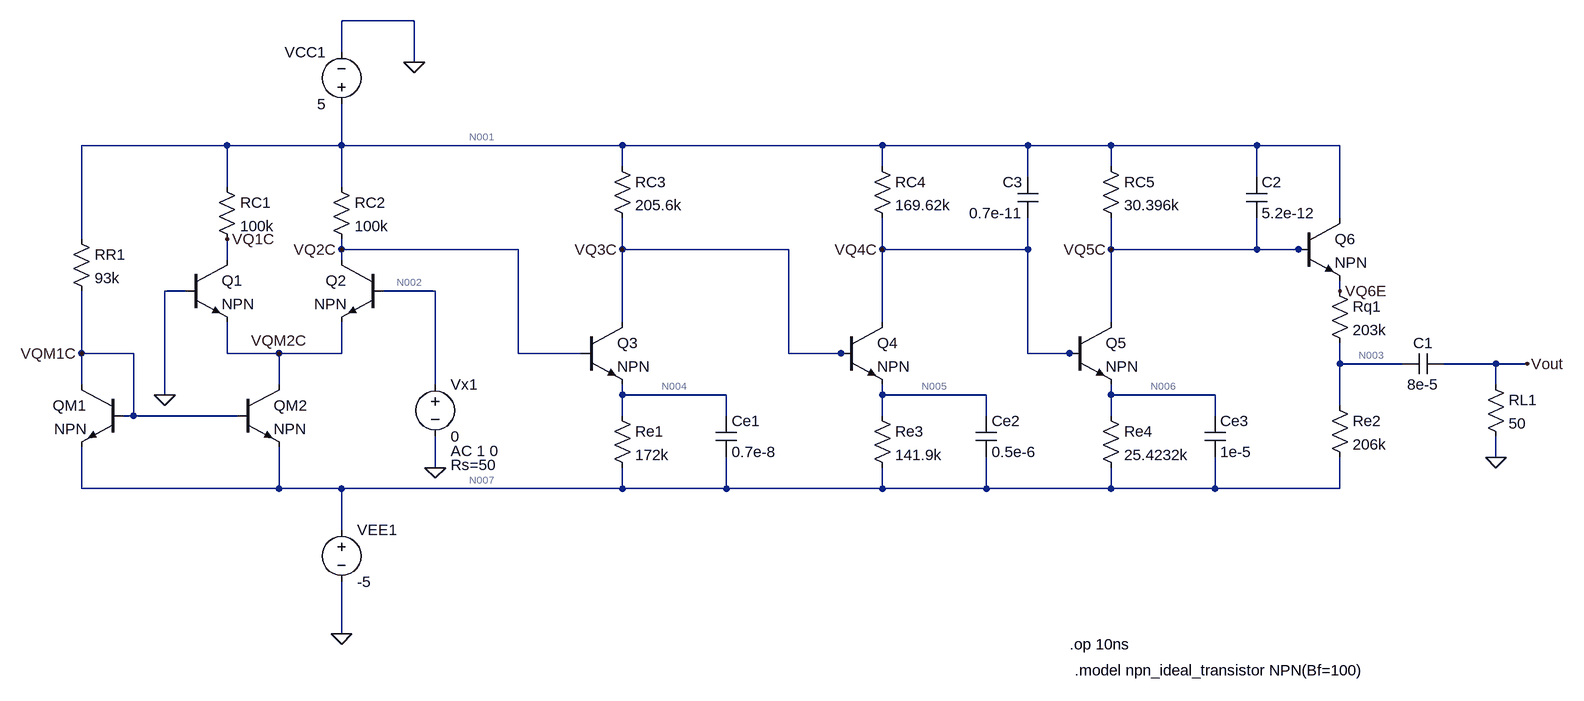
[diagram p0: schematic Bias Points.asc]
Bias Points.asc, the LTspice schematic file:
Version 4
SHEET 1 1460 848
WIRE -480 -288 -592 -288
WIRE -592 -240 -592 -288
WIRE -480 -224 -480 -288
WIRE -768 -96 -992 -96
WIRE -592 -96 -592 -160
WIRE -592 -96 -768 -96
WIRE -160 -96 -592 -96
WIRE 240 -96 -160 -96
WIRE 464 -96 240 -96
WIRE 592 -96 464 -96
WIRE 816 -96 592 -96
WIRE 944 -96 816 -96
WIRE -160 -64 -160 -96
WIRE 240 -64 240 -96
WIRE 592 -64 592 -96
WIRE 464 -48 464 -96
WIRE 816 -48 816 -96
WIRE -768 -32 -768 -96
WIRE -592 -32 -592 -96
WIRE 944 16 944 -96
WIRE -992 48 -992 -96
WIRE -592 64 -592 48
WIRE -320 64 -592 64
WIRE -160 64 -160 16
WIRE 96 64 -160 64
WIRE 240 64 240 16
WIRE 464 64 464 16
WIRE 464 64 240 64
WIRE 592 64 592 16
WIRE 816 64 816 16
WIRE 816 64 592 64
WIRE 880 64 816 64
WIRE 896 64 880 64
WIRE -768 80 -768 48
WIRE -592 80 -592 64
WIRE -832 128 -864 128
WIRE -448 128 -528 128
WIRE 944 128 944 112
WIRE -160 176 -160 64
WIRE 240 176 240 64
WIRE 592 176 592 64
WIRE -992 224 -992 128
WIRE -912 224 -992 224
WIRE -768 224 -768 176
WIRE -688 224 -768 224
WIRE -592 224 -592 176
WIRE -592 224 -688 224
WIRE -320 224 -320 64
WIRE -224 224 -320 224
WIRE 96 224 96 64
WIRE 176 224 96 224
WIRE 192 224 176 224
WIRE 464 224 464 64
WIRE 528 224 464 224
WIRE 544 224 528 224
WIRE 944 240 944 208
WIRE 1040 240 944 240
WIRE 1184 240 1104 240
WIRE 1232 240 1184 240
WIRE -992 272 -992 224
WIRE -688 272 -688 224
WIRE -448 272 -448 128
WIRE 1184 272 1184 240
WIRE -864 288 -864 128
WIRE -160 288 -160 272
WIRE 0 288 -160 288
WIRE 240 288 240 272
WIRE 400 288 240 288
WIRE 592 288 592 272
WIRE 752 288 592 288
WIRE 944 304 944 240
WIRE -912 320 -912 224
WIRE -912 320 -928 320
WIRE -752 320 -912 320
WIRE -160 320 -160 288
WIRE 0 320 0 288
WIRE 240 320 240 288
WIRE 400 320 400 288
WIRE 592 320 592 288
WIRE 752 320 752 288
WIRE 1184 384 1184 352
WIRE -448 400 -448 352
WIRE -992 432 -992 368
WIRE -688 432 -688 368
WIRE -688 432 -992 432
WIRE -592 432 -688 432
WIRE -160 432 -160 400
WIRE -160 432 -592 432
WIRE 0 432 0 384
WIRE 0 432 -160 432
WIRE 240 432 240 400
WIRE 240 432 0 432
WIRE 400 432 400 384
WIRE 400 432 240 432
WIRE 592 432 592 400
WIRE 592 432 400 432
WIRE 752 432 752 384
WIRE 752 432 592 432
WIRE 944 432 944 384
WIRE 944 432 752 432
WIRE -592 496 -592 432
WIRE -592 656 -592 576
FLAG -592 656 0
FLAG -480 -224 0
FLAG -448 400 0
FLAG 1184 384 0
FLAG 1232 240 Vout
FLAG -864 288 0
FLAG -768 48 VQ1C
FLAG -592 64 VQ2C
FLAG -688 224 VQM2C
FLAG -992 224 VQM1C
FLAG -160 64 VQ3C
FLAG 240 64 VQ4C
FLAG 592 64 VQ5C
FLAG 944 128 VQ6E
SYMBOL res -784 -48 R0
SYMATTR InstName RC1
SYMATTR Value 100k
SYMBOL res -608 -48 R0
SYMATTR InstName RC2
SYMATTR Value 100k
SYMBOL Res -176 304 R0
SYMATTR InstName Re1
SYMATTR Value 172k
SYMBOL Res -1008 32 R0
SYMATTR InstName RR1
SYMATTR Value 93k
SYMBOL Res -176 -80 R0
SYMATTR InstName RC3
SYMATTR Value 205.6k
SYMBOL npn -832 80 R0
SYMATTR InstName Q1
SYMBOL npn -224 176 R0
SYMATTR InstName Q3
SYMBOL npn -752 272 R0
SYMATTR InstName QM2
SYMBOL npn -928 272 M0
SYMATTR InstName QM1
SYMBOL npn -528 80 M0
SYMATTR InstName Q2
SYMBOL voltage -592 480 R0
SYMATTR InstName VEE1
SYMATTR Value -5
SYMBOL voltage -592 -144 R180
WINDOW 0 24 96 Left 2
WINDOW 3 24 16 Left 2
SYMATTR InstName VCC1
SYMATTR Value 5
SYMBOL voltage -448 256 R0
WINDOW 123 24 118 Left 2
WINDOW 39 24 140 Left 2
SYMATTR Value2 AC 1 0
SYMATTR SpiceLine Rs=50
SYMATTR InstName Vx1
SYMATTR Value 0
SYMBOL cap -16 320 R0
SYMATTR InstName Ce1
SYMATTR Value 0.7e-8
SYMBOL npn 880 16 R0
SYMATTR InstName Q6
SYMBOL Res 928 288 R0
SYMATTR InstName Re2
SYMATTR Value 206k
SYMBOL Res 1168 256 R0
SYMATTR InstName RL1
SYMATTR Value 50
SYMBOL cap 1104 224 R90
WINDOW 0 0 32 VBottom 2
WINDOW 3 32 32 VTop 2
SYMATTR InstName C1
SYMATTR Value 8e-5
SYMBOL Res 224 304 R0
SYMATTR InstName Re3
SYMATTR Value 141.9k
SYMBOL Res 224 -80 R0
SYMATTR InstName RC4
SYMATTR Value 169.62k
SYMBOL npn 176 176 R0
SYMATTR InstName Q4
SYMBOL cap 384 320 R0
SYMATTR InstName Ce2
SYMATTR Value 0.5e-6
SYMBOL Res 928 112 R0
SYMATTR InstName Rq1
SYMATTR Value 203k
SYMBOL Res 576 304 R0
SYMATTR InstName Re4
SYMATTR Value 25.4232k
SYMBOL Res 576 -80 R0
SYMATTR InstName RC5
SYMATTR Value 30.396k
SYMBOL npn 528 176 R0
SYMATTR InstName Q5
SYMBOL cap 736 320 R0
SYMATTR InstName Ce3
SYMATTR Value 1e-5
SYMBOL cap 800 -48 R0
SYMATTR InstName C2
SYMATTR Value 5.2e-12
SYMBOL cap 480 16 R180
WINDOW 0 24 56 Left 2
WINDOW 3 24 8 Left 2
SYMATTR InstName C3
SYMATTR Value 0.7e-11
TEXT 528 672 Left 2 !.op 10ns
TEXT 536 712 Left 2 !.model npn_ideal_transistor NPN(Bf=100)

The netlist it stands for:
* Bias Points.asc
RC1 N001 VQ1C 100k
RC2 N001 VQ2C 100k
Re1 N004 N007 172k
RR1 N001 VQM1C 93k
RC3 N001 VQ3C 205.6k
Q1 VQ1C 0 VQM2C 0 NPN
Q3 VQ3C VQ2C N004 0 NPN
QM2 VQM2C VQM1C N007 0 NPN
QM1 VQM1C VQM1C N007 0 NPN
Q2 VQ2C N002 VQM2C 0 NPN
VEE1 N007 0 -5
VCC1 N001 0 5
Vx1 N002 0 0 AC 1 0 Rs=50
Ce1 N004 N007 0.7e-8
Q6 N001 VQ5C VQ6E 0 NPN
Re2 N003 N007 206k
RL1 Vout 0 50
C1 Vout N003 8e-5
Re3 N005 N007 141.9k
RC4 N001 VQ4C 169.62k
Q4 VQ4C VQ3C N005 0 NPN
Ce2 N005 N007 0.5e-6
Rq1 VQ6E N003 203k
Re4 N006 N007 25.4232k
RC5 N001 VQ5C 30.396k
Q5 VQ5C VQ4C N006 0 NPN
Ce3 N006 N007 1e-5
C2 N001 VQ5C 5.2e-12
C3 VQ4C N001 0.7e-11
.model NPN NPN
.model PNP PNP
.lib standard.bjt
.op 10ns
.model npn_ideal_transistor NPN(Bf=100)
.backanno
.end

* Results of the author's LTspice run, read from the files saved beside the schematic
* Operating Point:
*   V(n001) = 5 V
*   V(vq1c) = 153.9 mV
*   V(vq2c) = 128 mV
*   V(n004) = -551.5 mV
*   V(n007) = -5 V
*   V(vqm1c) = -4.286 V
*   V(vq3c) = -321.5 mV
*   V(vqm2c) = -695.9 mV
*   V(n002) = 0 V
*   V(vq5c) = -46.55 mV
*   V(vq6e) = -702.7 mV
*   V(n003) = -2.836 V
*   V(vout) = -11.34 fV
*   V(n005) = -1.003 V
*   V(vq4c) = -11.76 mV
*   V(n006) = -739.5 mV
*   Ic(Q5) = 165.9 µA
*   Ib(Q5) = 1.659 µA
*   Ie(Q5) = -167.6 µA
*   Ic(Q4) = 27.89 µA
*   Ib(Q4) = 278.9 nA
*   Ie(Q4) = -28.17 µA
*   Ic(Q6) = 10.4 µA
*   Ib(Q6) = 104 nA
*   Ie(Q6) = -10.51 µA
*   Ic(Q2) = 48.46 µA
*   Ib(Q2) = 484.6 nA
*   Ie(Q2) = -48.95 µA
*   Ic(Qm1) = 97.89 µA
*   Ib(Qm1) = 978.9 nA
*   Ie(Qm1) = -98.87 µA
*   Ic(Qm2) = 97.89 µA
*   Ib(Qm2) = 978.9 nA
*   Ie(Qm2) = -98.87 µA
*   Ic(Q3) = 25.6 µA
*   Ib(Q3) = 259.6 nA
*   Ie(Q3) = -25.86 µA
*   Ic(Q1) = 48.46 µA
*   Ib(Q1) = 484.6 nA
*   Ie(Q1) = -48.95 µA
*   I(C3) = 0 A
*   I(C2) = 0 A
*   I(Ce3) = 0 A
*   I(Ce2) = 0 A
*   I(C1) = 0 A
*   I(Ce1) = 0 A
*   I(Rc5) = 166 µA
*   I(Re4) = 167.6 µA
*   I(Rq1) = 10.51 µA
*   I(Rc4) = 29.55 µA
*   I(Re3) = 28.17 µA
*   I(Rl1) = 0 A
*   I(Re2) = 10.51 µA
*   I(Rc3) = 25.88 µA
*   I(Rr1) = 99.85 µA
*   I(Re1) = 25.86 µA
*   I(Rc2) = 48.72 µA
*   I(Rc1) = 48.46 µA
*   I(Vx1) = -484.6 nA
*   I(Vcc1) = -428.9 µA
*   I(Vee1) = 429.9 µA
* From the log:
*   Semiconductor Device Operating Points:
*                           --- Bipolar Transistors ---
*   Name:       q5          q4          q6          q2          qm1
*   Model:      npn         npn         npn         npn         npn
*   Ib:       1.66e-06    2.79e-07    1.04e-07    4.85e-07    9.79e-07
*   Ic:       1.66e-04    2.79e-05    1.04e-05    4.85e-05    9.79e-05
*   Vbe:      7.28e-01    6.82e-01    6.56e-01    6.96e-01    7.14e-01
*   Vbc:      3.48e-02   -3.10e-01   -5.05e+00   -1.28e-01    0.00e+00
*   Vce:      6.93e-01    9.91e-01    5.70e+00    8.24e-01    7.14e-01
*   BetaDC:   1.00e+02    1.00e+02    1.00e+02    1.00e+02    1.00e+02
*   Gm:       6.41e-03    1.08e-03    4.02e-04    1.87e-03    3.78e-03
*   Rpi:      1.56e+04    9.27e+04    2.49e+05    5.34e+04    2.64e+04
*   Rx:       0.00e+00    0.00e+00    0.00e+00    0.00e+00    0.00e+00
*   Ro:       6.74e+13    4.11e+19    0.00e+00    3.64e+16    2.59e+14
*   Cbe:      0.00e+00    0.00e+00    0.00e+00    0.00e+00    0.00e+00
*   Cbc:      0.00e+00    0.00e+00    0.00e+00    0.00e+00    0.00e+00
*   Cjs:      0.00e+00    0.00e+00    0.00e+00    0.00e+00    0.00e+00
*   BetaAC:   1.00e+02    1.00e+02    1.00e+02    1.00e+02    1.00e+02
*   Cbx:      0.00e+00    0.00e+00    0.00e+00    0.00e+00    0.00e+00
*   Ft:       0.00e+00    0.00e+00    0.00e+00    0.00e+00    0.00e+00
*   Name:       qm2         q3          q1
*   Model:      npn         npn         npn
*   Ib:       9.79e-07    2.60e-07    4.85e-07
*   Ic:       9.79e-05    2.56e-05    4.85e-05
*   Vbe:      7.14e-01    6.79e-01    6.96e-01
*   Vbc:     -3.59e+00    4.49e-01   -1.54e-01
*   Vce:      4.30e+00    2.30e-01    8.50e-01
*   BetaDC:   1.00e+02    9.86e+01    1.00e+02
*   Gm:       3.78e-03    9.90e-04    1.87e-03
*   Rpi:      2.64e+04    1.01e+05    5.34e+04
*   Rx:       0.00e+00    0.00e+00    0.00e+00
*   Ro:       4.91e+74    7.33e+06    9.94e+16
*   Cbe:      0.00e+00    0.00e+00    0.00e+00
*   Cbc:      0.00e+00    0.00e+00    0.00e+00
*   Cjs:      0.00e+00    0.00e+00    0.00e+00
*   BetaAC:   1.00e+02    1.00e+02    1.00e+02
*   Cbx:      0.00e+00    0.00e+00    0.00e+00
*   Ft:       0.00e+00    0.00e+00    0.00e+00
*   Operating Bias Point Solution:
*   V(n001)                  5   voltage
*   V(vq1c)           0.153944   voltage
*   V(vq2c)            0.12798   voltage
*   V(n004)          -0.551463   voltage
*   V(n007)                 -5   voltage
*   V(vqm1c)           -4.28588   voltage
*   V(vq3c)          -0.321509   voltage
*   V(vqm2c)          -0.695938   voltage
*   V(n002)                  0   voltage
*   V(vq5c)         -0.0465492   voltage
*   V(vq6e)           -0.70269   voltage
*   V(n003)           -2.83558   voltage
*   V(vout)       -1.13423e-14   voltage
*   V(n005)           -1.00316   voltage
*   V(vq4c)         -0.0117585   voltage
*   V(n006)           -0.73953   voltage
*   Ic(Q5)        0.000165923   device_current
*   Ib(Q5)        1.65923e-06   device_current
*   Ie(Q5)       -0.000167582   device_current
*   Ic(Q4)        2.78878e-05   device_current
*   Ib(Q4)        2.78878e-07   device_current
*   Ie(Q4)       -2.81666e-05   device_current
*   Ic(Q6)        1.04028e-05   device_current
*   Ib(Q6)        1.04024e-07   device_current
*   Ie(Q6)       -1.05069e-05   device_current
*   Ic(Q2)        4.84606e-05   device_current
*   Ib(Q2)        4.84606e-07   device_current
*   Ie(Q2)       -4.89452e-05   device_current
*   Ic(Qm1)        9.78903e-05   device_current
*   Ib(Qm1)        9.78904e-07   device_current
*   Ie(Qm1)       -9.88692e-05   device_current
*   Ic(Qm2)        9.78903e-05   device_current
*   Ib(Qm2)          9.789e-07   device_current
*   Ie(Qm2)       -9.88692e-05   device_current
*   Ic(Q3)         2.5604e-05   device_current
*   Ib(Q3)        2.59637e-07   device_current
*   Ie(Q3)       -2.58636e-05   device_current
*   Ic(Q1)        4.84606e-05   device_current
*   Ib(Q1)        4.84606e-07   device_current
*   Ie(Q1)       -4.89452e-05   device_current
*   I(C3)       -3.50823e-23   device_current
*   I(C2)        2.62421e-23   device_current
*   I(Ce3)        4.26047e-17   device_current
*   I(Ce2)        1.99842e-18   device_current
*   I(C1)        2.26847e-16   device_current
*   I(Ce1)        3.11398e-20   device_current
*   I(Rc5)        0.000166027   device_current
*   I(Re4)        0.000167582   device_current
*   I(Rq1)        1.05069e-05   device_current
*   I(Rc4)         2.9547e-05   device_current
*   I(Re3)        2.81666e-05   device_current
*   I(Rl1)       -2.26847e-16   device_current
*   I(Re2)        1.05069e-05   device_current
*   I(Rc3)        2.58828e-05   device_current
*   I(Rr1)        9.98481e-05   device_current
*   I(Re1)        2.58636e-05   device_current
*   I(Rc2)        4.87202e-05   device_current
*   I(Rc1)        4.84606e-05   device_current
*   I(Vx1)       -4.84606e-07   device_current
*   I(Vcc1)       -0.000428888   device_current
*   I(Vee1)        0.000429858   device_current